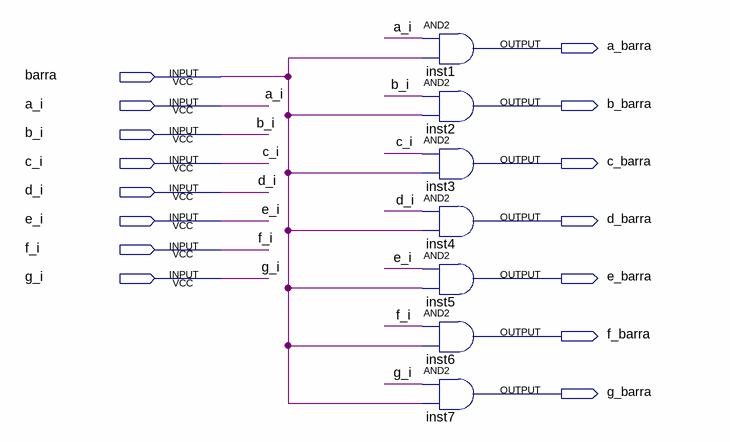
[diagram p0: schematic sheet]
// Quartus schematic output_barrado.bdf as structural Verilog: 7 symbols, 15 pins
module output_barrado (
  input  barra,
  input  a_i,
  input  b_i,
  input  c_i,
  input  d_i,
  input  e_i,
  input  f_i,
  input  g_i,
  output a_barra,
  output b_barra,
  output c_barra,
  output d_barra,
  output e_barra,
  output f_barra,
  output g_barra
);

  and inst1 (a_barra, a_i, barra);
  and inst2 (b_barra, b_i, barra);
  and inst3 (c_barra, c_i, barra);
  and inst4 (d_barra, d_i, barra);
  and inst5 (e_barra, e_i, barra);
  and inst6 (f_barra, f_i, barra);
  and inst7 (g_barra, g_i, barra);
endmodule
